# EAGLE schematic TMK-EURO (EAGLE 8.1.0)
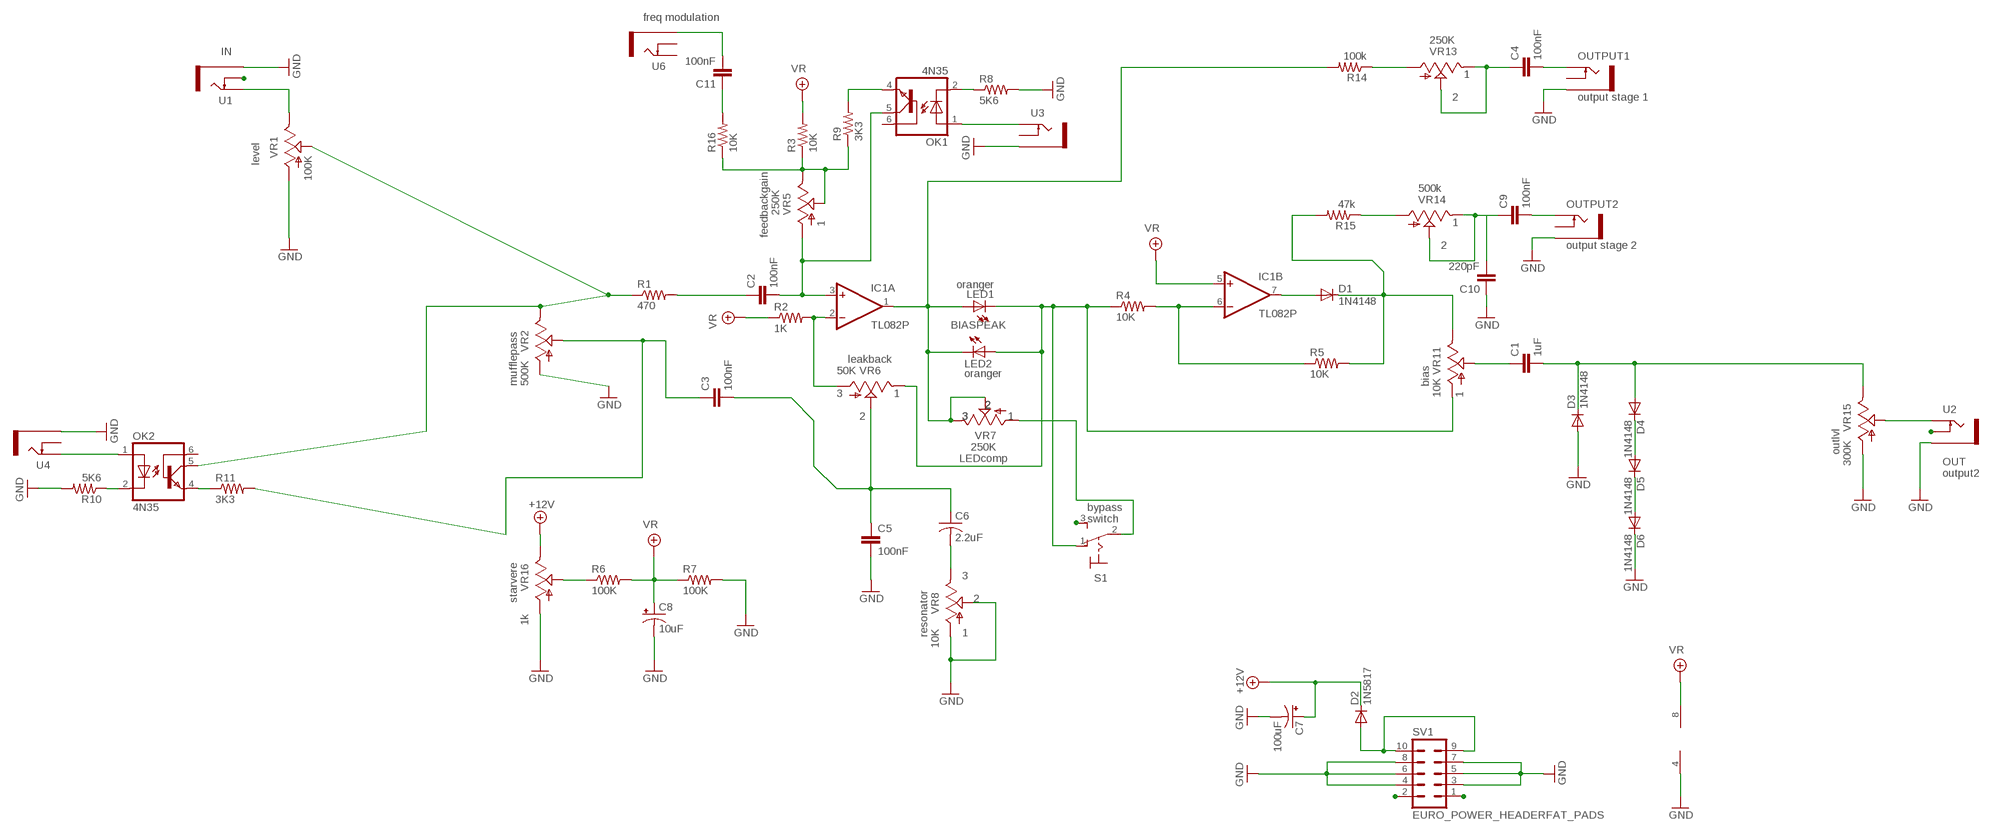
[diagram p0: schematic, sheet 1]

## Parts
C1  1uF  C-EU050-035X075  [C050-035X075]
C2  100nF  C-EU050-035X075  [C050-035X075]
C3  100nF  C-EU050-035X075  [C050-035X075]
C4  100nF  C-EU050-035X075  [C050-035X075]
C5  100nF  C-EU050-035X075  [C050-035X075]
C6  2.2uF  C-US050-030X075  [C050-030X075]
C7  100uF  CPOL-USE2-5  [E2-5]
C8  10uF  CPOL-USE2-5  [E2-5]
C9  100nF  C-EU050-035X075  [C050-035X075]
C10  220pF  C-EU050-035X075  [C050-035X075]
C11  100nF  C-EU050-035X075  [C050-035X075]
D1  1N4148  SMALL_DIODEDO35-7  [DO35-7]
D2  1N5817  SMALL_DIODEDO35-7  [DO35-7]
D3  1N4148  SMALL_DIODEDO35-7  [DO35-7]
D4  1N4148  SMALL_DIODEDO35-7  [DO35-7]
D5  1N4148  SMALL_DIODEDO35-7  [DO35-7]
D6  1N4148  SMALL_DIODEDO35-7  [DO35-7]
IC1  TL082P  [DIL08]
LED1  oranger  LED3MM  [LED3MM]
LED2  oranger  LED3MM  [LED3MM]
OK1  4N35  [DIL06]
OK2  4N35  [DIL06]
OUTPUT1  IN  THONKICONNOLD  [THONKICONN]
OUTPUT2  IN  THONKICONNOLD  [THONKICONN]
R1  470  R-US_0207/7  [0207/7]
R2  1K  R-US_0207/7  [0207/7]
R3  10K  R-US_0207/7  [0207/7]
R4  10K  R-US_0207/7  [0207/7]
R5  10K  R-US_0207/7  [0207/7]
R6  100K  R-US_0207/7  [0207/7]
R7  100K  R-US_0207/7  [0207/7]
R8  5K6  R-US_0207/7  [0207/7]
R9  3K3  R-US_0207/7  [0207/7]
R10  5K6  R-US_0207/7  [0207/7]
R11  3K3  R-US_0207/7  [0207/7]
R14  100k  R-US_0207/7  [0207/7]
R15  47k  R-US_0207/7  [0207/7]
R16  10K  R-US_0207/7  [0207/7]
S1  320-916  [320-916]
SV1  EURO_POWER_HEADERFAT_PADS  [EURO_PWR_HEADER_FAT]
U1  IN  THONKICONNOLD  [THONKICONN]
U2  THONKICONNOLD  [THONKICONN]
U3  IN  THONKICONNOLD  [THONKICONN]
U4  IN  THONKICONNOLD  [THONKICONN]
U6  IN  THONKICONNOLD  [THONKICONN]
VR1  100K  9MM_SNAP-IN_POT_  [9MM_SNAP-IN_POT]
VR2  500K  9MM_SNAP-IN_POT_  [9MM_SNAP-IN_POT]
VR5  250K  9MM_SNAP-IN_POT_  [9MM_SNAP-IN_POT]
VR6  50K  9MM_SNAP-IN_POT_  [9MM_SNAP-IN_POT]
VR7  250K  9MM_SNAP-IN_POT_  [9MM_SNAP-IN_POT]
VR8  10K  9MM_SNAP-IN_POT_  [9MM_SNAP-IN_POT]
VR11  10K  9MM_SNAP-IN_POT_  [9MM_SNAP-IN_POT]
VR13  250K  9MM_SNAP-IN_POT_  [9MM_SNAP-IN_POT]
VR14  500k  9MM_SNAP-IN_POT_  [9MM_SNAP-IN_POT]
VR15  300K  9MM_SNAP-IN_POT_  [9MM_SNAP-IN_POT]
VR16  1k  9MM_SNAP-IN_POT_  [9MM_SNAP-IN_POT]

## Nets
+12V: C7.+ D2.C VR16.3(E)
BYPASS: S1.2(P) VR7.1(A)
GND: C5.2 C7.- C8.- C10.1 D3.A D6.C IC1.4(P:V-) OUTPUT1.P$1_SLEEVE(SLEEVE) OUTPUT2.P$1_SLEEVE(SLEEVE) R7.2 R8.2 R10.2 SV1.3 SV1.4 SV1.5 SV1.6 SV1.7 SV1.8 U1.P$1_SLEEVE(SLEEVE) U2.P$1_SLEEVE(SLEEVE) U3.P$1_SLEEVE(SLEEVE) U4.P$1_SLEEVE(SLEEVE) VR1.1(A) VR2.1(A) VR8.1(A) VR8.2(S) VR15.1(A) VR16.1(A)
IN: U1.P$3_TIP(TIP) VR1.3(E)
N$1: U1.P$2_SWITCH(SWITCH)
N$2: OK2.5(COL) R1.1 VR1.2(S) VR2.3(E)
N$3: C2.1 R1.2
N$4: C2.2 IC1.3(A:+IN) OK1.5(COL) VR5.1(A)
N$5: R3.1 R9.1 R16.1 VR5.2(S) VR5.3(E)
N$6: IC1.2(A:-IN) R2.2 VR6.1(A)
N$7: LED1.K(C) LED2.A R4.1 S1.1(O) VR6.3(E) VR11.1(A)
N$8: C6.2 VR8.3(E)
N$9: C3.1 R11.2 VR2.2(S)
N$10: IC1.1(A:OUT) LED1.A LED2.K(C) R14.2 VR7.2(S) VR7.3(E)
N$11: C3.2 C5.1 C6.1 VR6.2(S)
N$12: IC1.6(B:-IN) R4.2 R5.1
N$13: D1.C R5.2 R15.2 VR11.3(E)
N$14: D1.A IC1.7(B:OUT)
N$15: SV1.2
N$16: D2.A SV1.9 SV1.10
N$17: SV1.1
N$18: C1.1 VR11.2(S)
N$19: U2.P$3_TIP(TIP) VR15.2(S)
N$20: C1.2 D3.C D4.A VR15.3(E)
N$21: D4.C D5.A
N$22: D5.C D6.A
N$23: R6.1 VR16.2(S)
N$24: U2.P$2_SWITCH(SWITCH)
N$25: C4.2 OUTPUT1.P$3_TIP(TIP)
N$26: R14.1 VR13.1(A)
N$27: OK1.4(EMI) R9.2
N$28: OK1.2(C) R8.1
N$29: R15.1 VR14.1(A)
N$30: OK1.1(A) U3.P$3_TIP(TIP)
N$31: OK2.4(EMI) R11.1
N$32: OK2.2(C) R10.1
N$33: OK2.1(A) U4.P$3_TIP(TIP)
N$34: S1.3(S)
N$35: C9.2 OUTPUT2.P$3_TIP(TIP)
N$36: C11.1 R16.2
N$40: C11.2 U6.P$1_SLEEVE(SLEEVE)
OUTPUT1: C4.1 VR13.2(S) VR13.3(E)
OUTPUT2: C9.1 C10.2 VR14.2(S) VR14.3(E)
VR: C8.+ IC1.5(B:+IN) IC1.8(P:V+) R2.1 R3.2 R6.2 R7.1
Unconnected: OK1.6(BAS) OK2.6(BAS) OUTPUT1.P$2_SWITCH(SWITCH) OUTPUT2.P$2_SWITCH(SWITCH) U3.P$2_SWITCH(SWITCH) U4.P$2_SWITCH(SWITCH) U6.P$2_SWITCH(SWITCH) U6.P$3_TIP(TIP)

## Notes on the sheet
- freq modulation
- IN
- 1
- 2 | output stage 1
- level
- 1 | 1
- feedbackgain
- 2 | output stage 2
- BIASPEAK
- leakback
- mufflepass | bias
- 3 | 1 | 1
- 2 | 2
- 2 | 3 | 3 | 1
- LEDcomp | outlvl
- OUT
- output2
- bypass
- switch
- 3
- starvere | 2
- resonator | 1

## Library data of the parts
C1-C5 C9-C11 = rcl:C-EU: CAPACITOR, European symbol
C6 = adafruit:C-US: CAPACITOR, American symbol
C7 C8 = adafruit:CPOL-US: POLARIZED CAPACITOR, American symbol
D1-D6 = MusicThingModular:SMALL_DIODE: Small Signal Diode
IC1 = linear:TL082: OP AMP Data sheet <http://www.ti.com/lit/ds/symlink/tl084a . pdf>; DATA_SHEET: <a href="http://www.ti.com/lit/ds/symlink/tl084a.pdf"> Data sheet </a>
LED1 LED2 = adafruit:LED: LED OSRAM: - CHIPLED LG R971, LG N971, LY N971, LG Q971, LY Q971, LO R971, LY R971 LH N974, LH R974 LS Q976, LO Q976, LY Q976 LO Q996 - Hyper CHIPLED LW Q18S LB Q993, LB Q99A, LB R99A - SideLED LS A670, LO A670, LY A670, LG A670, LP A670 LB A673, LV A673, LT A673, LW A673 LH A674 LY A675 LS A676, LA A676, LO A676, LY A676, LW A676 LS A679, LY A679, LG A679 - Hyper Micro SIDELED® LS Y876, LA Y876, LO Y876, LY Y876 LT Y87S - SmartLED LW L88C, LW L88S LB L89C, LB L89S, LG L890 LS L89K, LO L89K, LY L89K LS L896, LA L896, LO L896, LY L896 - TOPLED LS T670, LO T670, LY T670, LG T670, LP T670 LSG T670, LSP T670, LSY T670, LOP T670, LYG T670 LG T671, LOG T671, LSG T671 LB T673, LV T673, LT T673, LW T673 LH T674 LS T676, LA T676, LO T676, LY T676, LB T676, LH T676, LSB T676, LW T676 LB T67C, LV T67C, LT T67C, LS T67K, LO T67K, LY T67K, LW E67C LS E67B, LA E67B, LO E67B, LY E67B, LB E67C, LV E67C, LT E67C LW T67C LS T679, LY T679, LG T679 LS T770, LO T770, LY T770, LG T770, LP T770 LB T773, LV T773, LT T773, LW T773 LH T774 LS E675, LA E675, LY E675, LS T675 LS T776, LA T776, LO T776, LY T776, LB T776 LHGB T686 LT T68C, LB T68C - Hyper Mini TOPLED® LB M676 - Mini TOPLED Santana® LG M470 LS M47K, LO M47K, LY M47K Source: http://www.osram.convergy.de/
OK1 OK2 = optocoupler:4N35: MOTOROLA OPTO COUPLER; MF: FAIRCHILD SEMICONDUCTOR; MPN: 4N35; OC_FARNELL: 1328375; OC_NEWARK: 72K9946
OUTPUT1 OUTPUT2 U1-U4 U6 = MusicThingModular:THONKICONN: 3.5mm socket for Eurorack modular synths
R1-R11 R14-R16 = adafruit:R-US_: RESISTOR, American symbol
S1 = switch:320-916: TOGGLE SWITCH distributor RS Components
SV1 = MusicThingModular:EURO_POWER_HEADER: Power Header 10 pin power header for Eurorack Power Supplies Variants with fatter pads for easier soldering, and the LOCK variant which has 5mil offset pins to hold the component in place before soldering
VR1 VR2 VR5-VR8 VR11 VR13-VR16 = MusicThingModular:9MM_SNAP-IN_POT: 9mm vertical snap-in pot, Alpha / Panasonic style